# EAGLE schematic TigardBR (EAGLE 9.6.2)
H1: Controlando Elétrons; H2: github.com/ControlandoEletrons; PROJECT: TigardBR; VERSION: 1.0
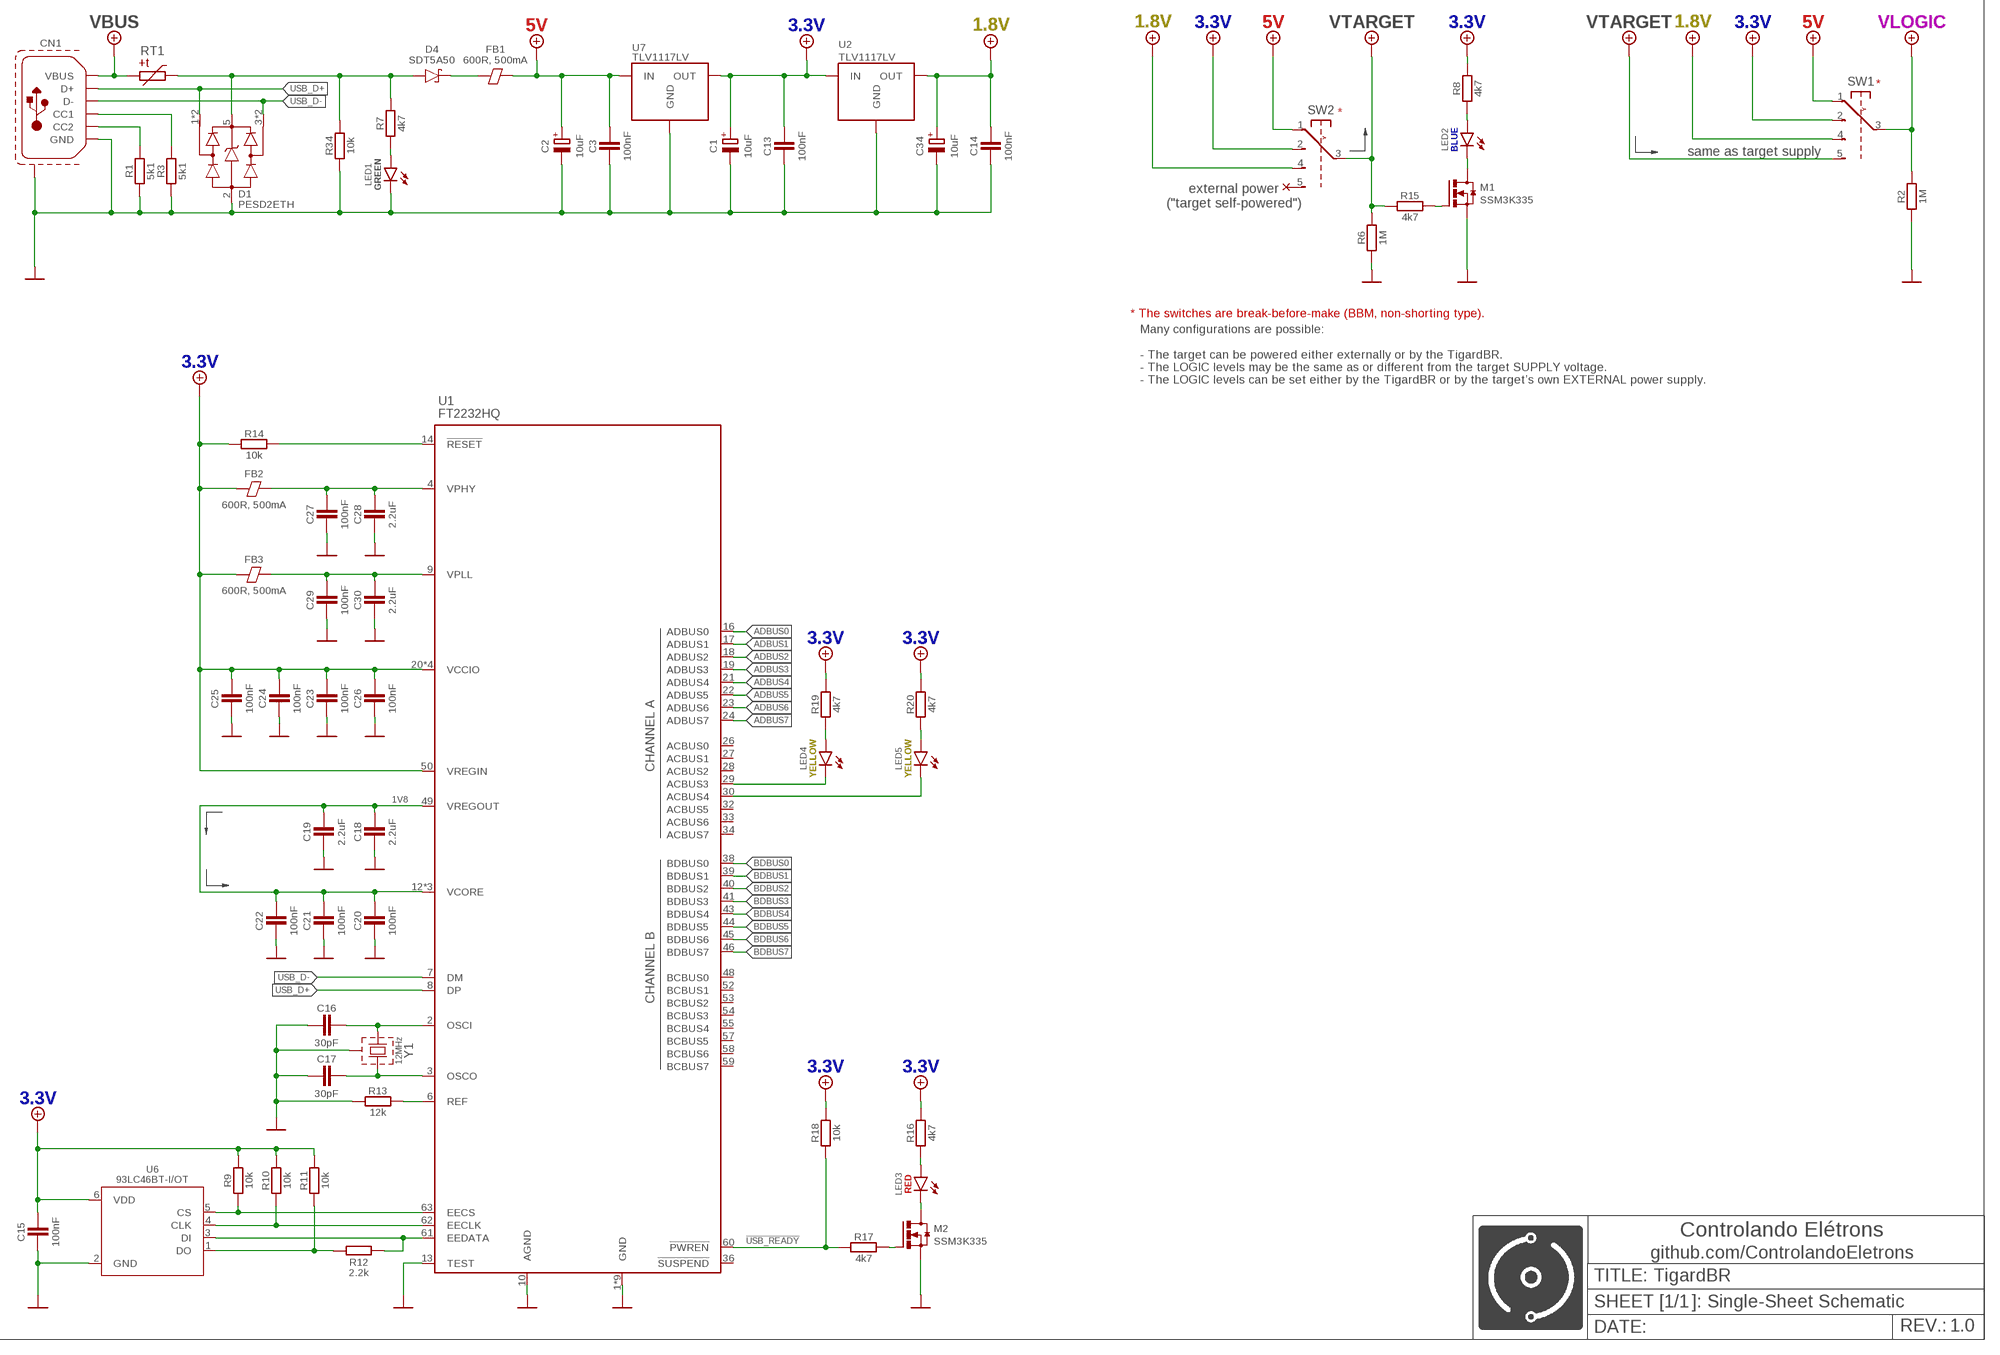
[diagram p0: schematic, sheet 1, part 1 of 3]
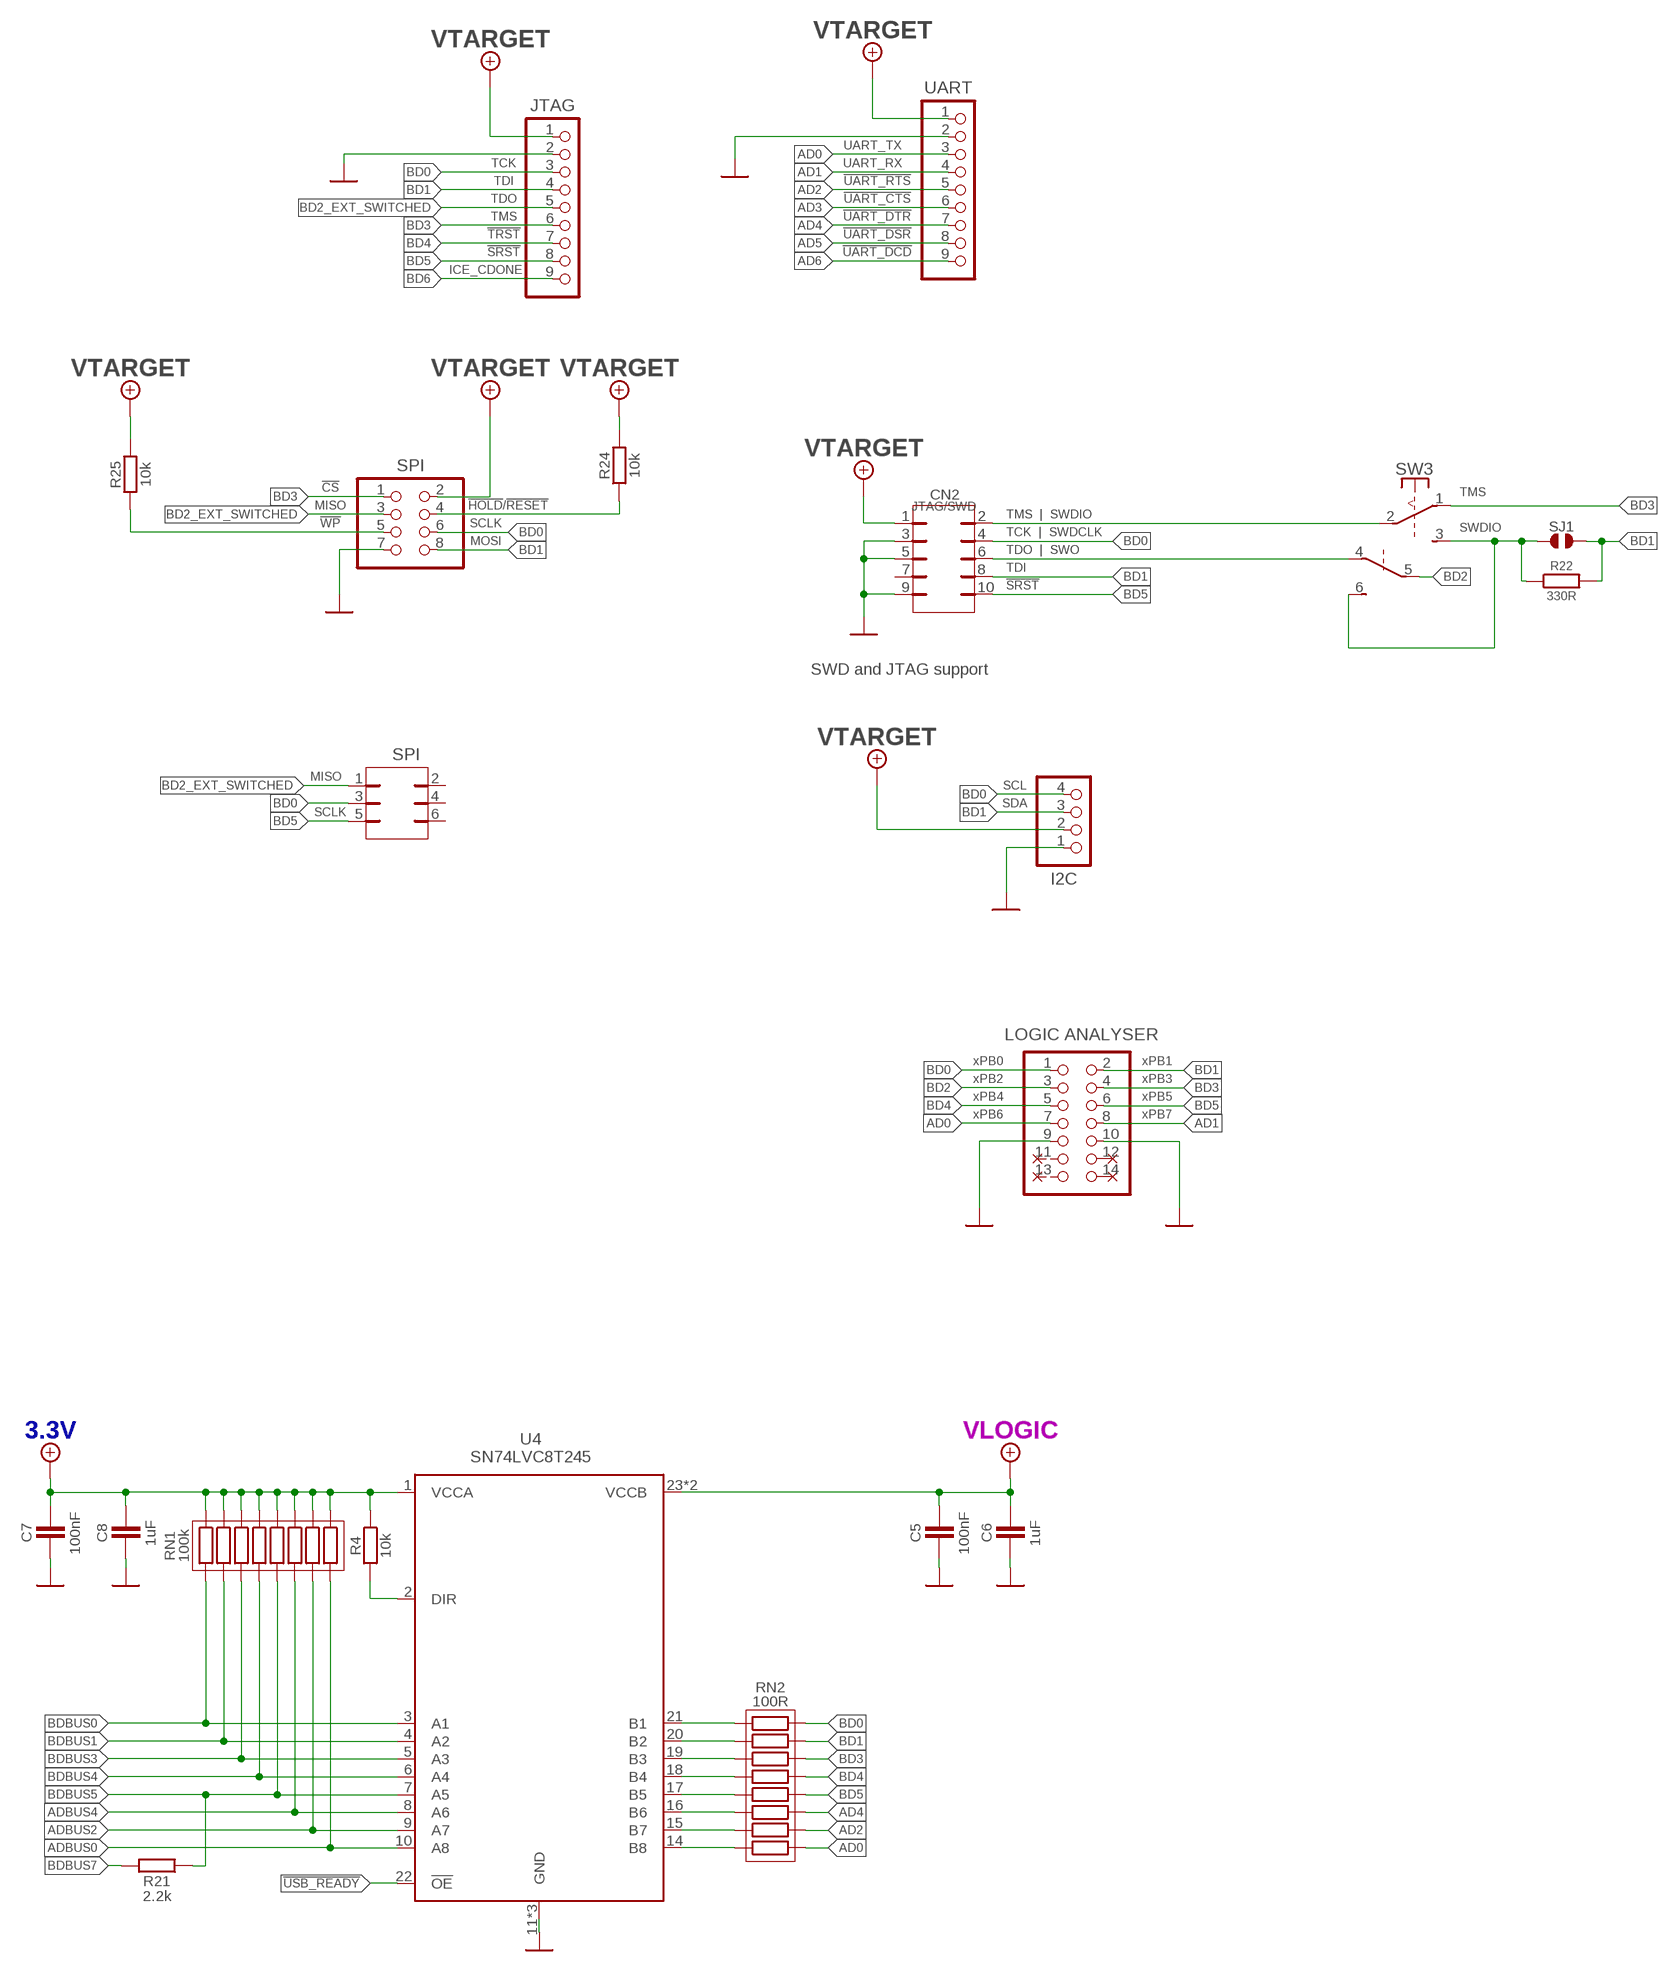
[diagram p1: schematic, sheet 1, part 2 of 3]
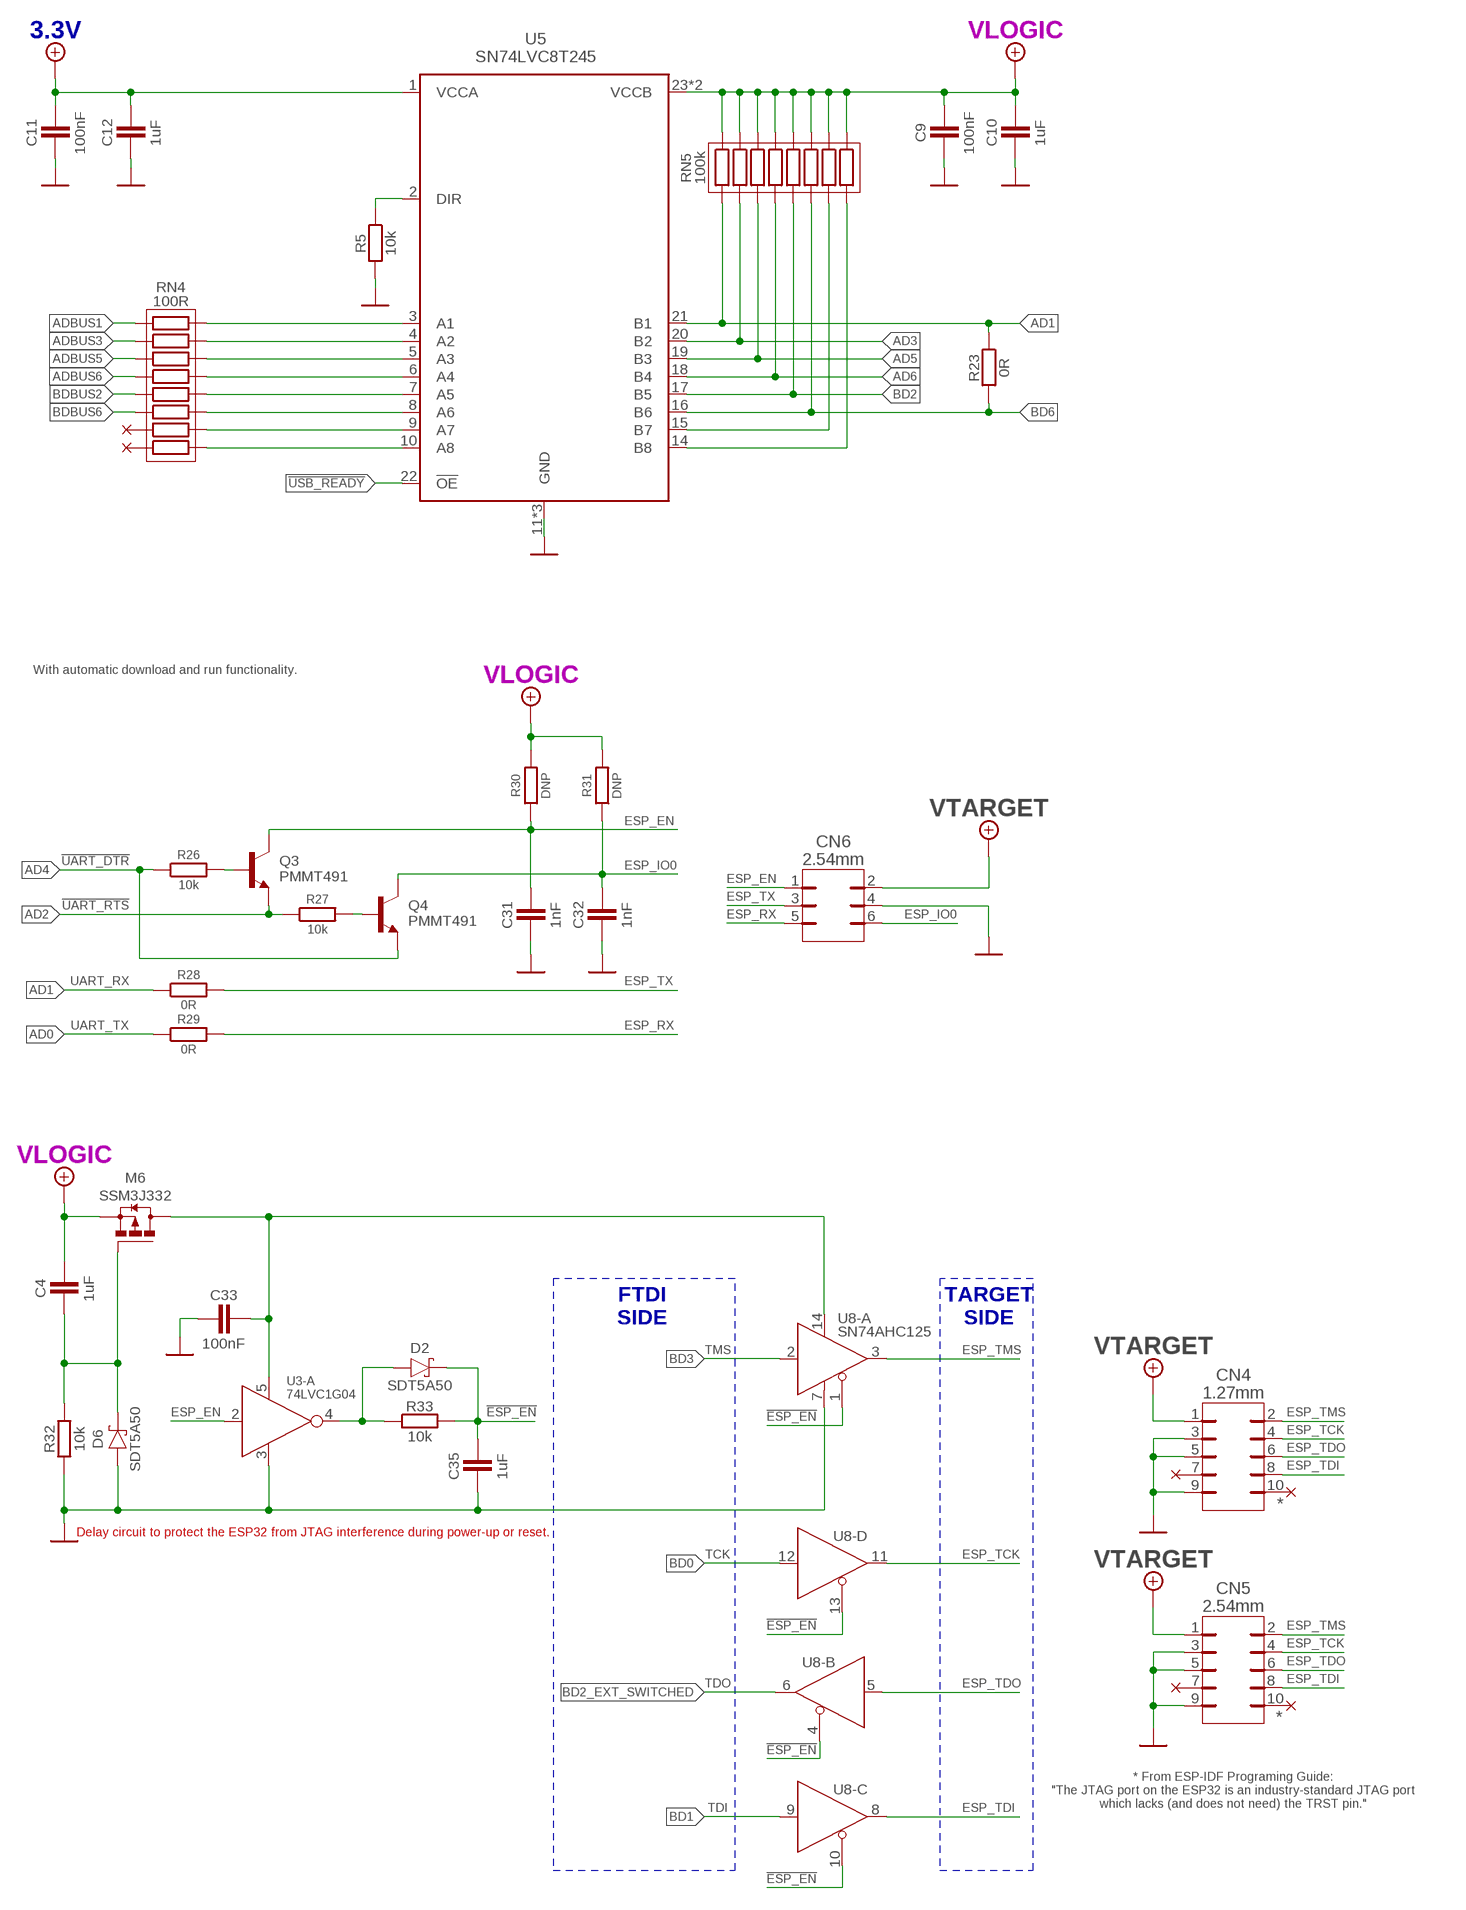
[diagram p2: schematic, sheet 1, part 3 of 3]
U$1 (NC): _EXTERNAL_: _EXTERNAL_
U$2 (NC): _EXTERNAL_: _EXTERNAL_
U$3 (NC): _EXTERNAL_: _EXTERNAL_
U$4 (NC): _EXTERNAL_: _EXTERNAL_
U$5 (NC): _EXTERNAL_: _EXTERNAL_
U$6 (NC): _EXTERNAL_: _EXTERNAL_
U$7 (NC): _EXTERNAL_: _EXTERNAL_
U$8 (NC): _EXTERNAL_: _EXTERNAL_
U$9 (NC): _EXTERNAL_: _EXTERNAL_
U$10 (NC): _EXTERNAL_: _EXTERNAL_
U$11 (NC): _EXTERNAL_: _EXTERNAL_
U$12 (NC): _EXTERNAL_: _EXTERNAL_

## Parts
C1  10uF  CP_1206_POL  [C1206_POL]
C2  10uF  CP_1206_POL  [C1206_POL]
C3  100nF  C_0603  [C0603]
C4  1uF  C_0603  [C0603]
C5  100nF  C_0603  [C0603]
C6  1uF  C_0603  [C0603]
C7  100nF  C_0603  [C0603]
C8  1uF  C_0603  [C0603]
C9  100nF  C_0603  [C0603]
C10  1uF  C_0603  [C0603]
C11  100nF  C_0603  [C0603]
C12  1uF  C_0603  [C0603]
C13  100nF  C_0603  [C0603]
C14  100nF  C_0603  [C0603]
C15  100nF  C_0603  [C0603]
C16  30pF  C_0603  [C0603]
C17  30pF  C_0603  [C0603]
C18  2.2uF  C_0603  [C0603]
C19  2.2uF  C_0603  [C0603]
C20  100nF  C_0603  [C0603]
C21  100nF  C_0603  [C0603]
C22  100nF  C_0603  [C0603]
C23  100nF  C_0603  [C0603]
C24  100nF  C_0603  [C0603]
C25  100nF  C_0603  [C0603]
C26  100nF  C_0603  [C0603]
C27  100nF  C_0603  [C0603]
C28  2.2uF  C_0603  [C0603]
C29  100nF  C_0603  [C0603]
C30  2.2uF  C_0603  [C0603]
C31  1nF  C_0603  [C0603]
C32  1nF  C_0603  [C0603]
C33  100nF  C_0603  [C0603]
C34  10uF  CP_1206_POL  [C1206_POL]
C35  1uF  C_0603  [C0603]
CN1  USB-C-16P  [USB-C-16P]
CN2  JTAG/SWD  JTAG  [JTAG-ARM-10P]
CN3  I2C  PINHD-1X04_2.54  [1X04]
CN4  1.27mm  JTAG  [JTAG-ARM-10P]
CN5  2.54mm  PINHD-2X05_2.54  [2X05]
CN6  2.54mm  PINHD-2X03_2.54  [2X03]
D1  TVS-ARRAY-2  [TSOP-6]
D2  SDT5A50  SCHOTTKY-SDT5A50SA  [DO-214AC]
D4  SDT5A50  SCHOTTKY-SDT5A50SA  [DO-214AC]
D6  SDT5A50  SCHOTTKY-SDT5A50SA  [DO-214AC]
FB1  600R, 500mA  FB_0603  [L0603]
FB2  600R, 500mA  FB_0603  [L0603]
FB3  600R, 500mA  FB_0603  [L0603]
JP1  JTAG  PINHD-1X09_2.54  [1X09]
JP2  SPI  PINHD-2X04_2.54  [2X04]
JP3  UART  PINHD-1X09_2.54  [1X09]
JP4  LOGIC ANALYSER  PINHD-2X07_2.54  [2X07]
JP5  SPI  PINHD-2X03_2.54  [2X03]
LED1  GREEN  LED-0603-G  [L0603G]
LED2  BLUE  LED-0603-B  [L0603B]
LED3  RED  LED-0603-R  [L0603R]
LED4  YELLOW  LED-0603-Y  [L0603Y]
LED5  YELLOW  LED-0603-Y  [L0603Y]
M1  SSM3K335  MOSFET-N-SSM3K335R  [SOT23-3]
M2  SSM3K335  MOSFET-N-SSM3K335R  [SOT23-3]
M6  SSM3J332  MOSFET-P-SSM3J332R  [SOT23-3]
Q3  PMMT491  BJT-N-PMMT491  [SOT23-3]
Q4  PMMT491  BJT-N-PMMT491  [SOT23-3]
R1  5k1  R_0603  [R0603]
R2  1M  R_0603  [R0603]
R3  5k1  R_0603  [R0603]
R4  10k  R_0603  [R0603]
R5  10k  R_0603  [R0603]
R6  1M  R_0603  [R0603]
R7  4k7  R_0603  [R0603]
R8  4k7  R_0603  [R0603]
R9  10k  R_0603  [R0603]
R10  10k  R_0603  [R0603]
R11  10k  R_0603  [R0603]
R12  2.2k  R_0603  [R0603]
R13  12k  R_0603  [R0603]
R14  10k  R_0603  [R0603]
R15  4k7  R_0603  [R0603]
R16  4k7  R_0603  [R0603]
R17  4k7  R_0603  [R0603]
R18  10k  R_0603  [R0603]
R19  4k7  R_0603  [R0603]
R20  4k7  R_0603  [R0603]
R21  2.2k  R_0603  [R0603]
R22  330R  R_0603  [R0603]
R23  0R  R_0603  [R0603]
R24  10k  R_0603  [R0603]
R25  10k  R_0603  [R0603]
R26  10k  R_0603  [R0603]
R27  10k  R_0603  [R0603]
R28  0R  R_0603  [R0603]
R29  0R  R_0603  [R0603]
R30  DNP  R_0603  [R0603]
R31  DNP  R_0603  [R0603]
R32  10k  R_0603  [R0603]
R33  10k  R_0603  [R0603]
R34  10k  R_0603  [R0603]
RN1  100k  RN_  [RN0602]
RN2  100R  RN_  [RN0602]
RN4  100R  RN_  [RN0602]
RN5  100k  RN_  [RN0602]
RT1  PTC-  [F1812]
SJ1  2P-NO  [2P-NO-0603]
SW1  DP4T-  [SSSS224100]
SW2  DP4T-  [SSSS224100]
SW3  DP2T-STRAIGHT-SMD  [JS202011SCQN]
U1  FT2232HQ  [QFN-64]
U2  TLV1117LV  1117-3.3V  [SOT-223-3]
U3  74LVC1G04  SINGLE-INVERTER-74LVC1G04GV  [SOT753-5_(SC-74A)]
U4  SN74LVC8T245  [TSSOP-24]
U5  SN74LVC8T245  [TSSOP-24]
U6  93LC46BT-I/OT  [SOT23-6]
U7  TLV1117LV  1117-3.3V  [SOT-223-3]
U8  SN74AHC125  QUAD-BUFFER-  [SOIC-14]
Y1  12MHz  OSC-CHASSI-  [3.2MM_2.5MM]

## Nets
0V: C1.2(-) C2.2(-) C3.2 C5.2 C6.2 C7.2 C8.2 C9.2 C10.2 C11.2 C12.2 C13.2 C14.2 C15.2 C16.2 C17.2 C18.2 C19.2 C20.2 C21.2 C22.2 C23.2 C24.2 C25.2 C26.2 C27.2 C28.2 C29.2 C30.2 C31.2 C32.2 C33.2 C34.2(-) C35.2 CN1.A1_B12(GND) CN1.B1_A12(GND) CN1.S1(CHASSI) CN1.S2(CHASSI) CN1.S3(CHASSI) CN1.S4(CHASSI) CN2.3(GND) CN2.5(GND2) CN2.9(GND3) CN3.1 CN4.3(GND) CN4.5(GND2) CN4.9(GND3) CN5.3 CN5.5 CN5.9 CN6.4 D1.2(GND) D6.2(A) JP1.2 JP2.7 JP3.2 JP4.9 JP4.10 LED1.K M1.2(S) M2.2(S) R1.1 R2.1 R3.1 R5.2 R6.1 R13.2 R32.1 R34.1 U1.1(GND) U1.5(GND) U1.10(AGND) U1.11(GND) U1.13(TEST) U1.15(GND) U1.25(GND) U1.35(GND) U1.47(GND) U1.51(GND) U1.TP(GND) U2.1(GND) U3.3(VSS) U4.11(GND) U4.12(GND) U4.13(GND) U5.11(GND) U5.12(GND) U5.13(GND) U6.2(GND) U7.1(GND) U8.7(VSS) Y1.2(CH) Y1.4(CH)
1.8V: C14.1 C34.1(+) SW1.4(NO2) SW2.4(NO2) U2.2(OUT) U2.4(OUT)
1V8: C18.1 C19.1 C20.1 C21.1 C22.1 U1.12(VCORE) U1.37(VCORE) U1.49(VREGOUT) U1.64(VCORE)
3.3V: C1.1(+) C7.1 C8.1 C11.1 C12.1 C13.1 C15.1 C23.1 C24.1 C25.1 C26.1 FB2.1 FB3.1 R4.1 R8.2 R9.1 R10.1 R11.1 R14.2 R16.2 R18.1 R19.2 R20.2 RN1.1 RN1.2 RN1.3 RN1.4 RN1.5 RN1.6 RN1.7 RN1.8 SW1.2(NO1) SW2.2(NO1) U1.20(VCCIO) U1.31(VCCIO) U1.42(VCCIO) U1.50(VREGIN) U1.56(VCCIO) U2.3(IN) U4.1(VCCA) U5.1(VCCA) U6.6(VDD) U7.2(OUT) U7.4(OUT)
5.0V: C2.1(+) C3.1 FB1.2 SW1.1(NC) SW2.1(NC) U7.3(IN) ; supply symbol labelled 5V
!ESP_EN: C35.1 D2.1(K) R33.2 U8.1(-A:!OE) U8.4(-B:!OE) U8.10(-C:!OE) U8.13(-D:!OE)
!USB_READY: R17.1 R18.2 U1.60(!PWREN) U4.22(!OE) U5.22(!OE)
AD0: JP3.3 JP4.7 R29.1 RN2.9
AD1: JP3.4 JP4.8 R23.1 R28.1 RN5.16 U5.21(B1)
AD2: JP3.5 Q3.2(E) R27.1 RN2.10
AD3: JP3.6 RN5.15 U5.20(B2)
AD4: JP3.7 Q4.2(E) R26.1 RN2.11
AD5: JP3.8 RN5.14 U5.19(B3)
AD6: JP3.9 RN5.13 U5.18(B4)
ADBUS0: RN1.9 RN5.9 U1.16(ADBUS0) U4.10(A8) U5.14(B8)
ADBUS1: RN4.1 U1.17(ADBUS1)
ADBUS2: RN1.10 RN5.10 U1.18(ADBUS2) U4.9(A7) U5.15(B7)
ADBUS3: RN4.2 U1.19(ADBUS3)
ADBUS4: RN1.11 U1.21(ADBUS4) U4.8(A6)
ADBUS5: RN4.3 U1.22(ADBUS5)
ADBUS6: RN4.4 U1.23(ADBUS6)
ADBUS7: U1.24(ADBUS7)
BD0: CN2.4(TCK) CN3.4 JP1.3 JP2.6 JP4.1 JP5.3 RN2.16 U8.12(-D:A)
BD1: CN2.8(TDI) CN3.3 JP1.4 JP2.8 JP4.2 R22.2 RN2.15 SJ1.2 U8.9(-C:A)
BD2: JP4.3 RN5.12 SW3.5(SW2:C) U5.17(B5)
BD2_EXT_SWITCHED: CN2.6(TDO) JP1.5 JP2.3 JP5.1 SW3.4(SW2:NC) U8.6(-B:Y)
BD3: JP1.6 JP2.1 JP4.4 RN2.14 SW3.1(SW1:NC) U8.2(-A:A)
BD4: JP1.7 JP4.5 RN2.13
BD5: CN2.10(!RST) JP1.8 JP4.6 JP5.5 RN2.12
BD6: JP1.9 R23.2 RN5.11 U5.16(B6)
BDBUS0: RN1.16 U1.38(BDBUS0) U4.3(A1)
BDBUS1: RN1.15 U1.39(BDBUS1) U4.4(A2)
BDBUS2: RN4.5 U1.40(BDBUS2)
BDBUS3: RN1.14 U1.41(BDBUS3) U4.5(A3)
BDBUS4: RN1.13 U1.43(BDBUS4) U4.6(A4)
BDBUS5: R21.1 RN1.12 U1.44(BDBUS5) U4.7(A5)
BDBUS6: RN4.6 U1.45(BDBUS6)
BDBUS7: R21.2 U1.46(BDBUS7)
ESP_EN: C31.1 CN6.1 Q3.3(C) R30.1 U3.2(-A:A)
ESP_IO0: C32.1 CN6.6 Q4.3(C) R31.1
ESP_RX: CN6.5 R29.2
ESP_TCK: CN4.4(TCK) CN5.4 U8.11(-D:Y)
ESP_TDI: CN4.8(TDI) CN5.8 U8.8(-C:Y)
ESP_TDO: CN4.6(TDO) CN5.6 U8.5(-B:A)
ESP_TMS: CN4.2(TMS) CN5.2 U8.3(-A:Y)
ESP_TX: CN6.3 R28.2
N$1: LED2.A R8.1
N$2: R4.2 U4.2(DIR)
N$3: R5.1 U5.2(DIR)
N$4: RN4.16 U5.3(A1)
N$5: RN4.15 U5.4(A2)
N$6: RN4.14 U5.5(A3)
N$7: D4.1(K) FB1.1
N$8: RN4.13 U5.6(A4)
N$9: RN4.12 U5.7(A5)
N$10: RN4.11 U5.8(A6)
N$11: RN4.10 U5.9(A7)
N$12: RN2.1 U4.21(B1)
N$13: RN2.2 U4.20(B2)
N$14: RN2.3 U4.19(B3)
N$15: RN2.4 U4.18(B4)
N$16: RN2.5 U4.17(B5)
N$17: RN2.6 U4.16(B6)
N$18: RN2.7 U4.15(B7)
N$19: RN2.8 U4.14(B8)
N$20: LED2.K M1.3(D)
N$21: RN4.9 U5.10(A8)
N$22: R9.2 U1.63(EECS) U6.5(CS)
N$23: R10.2 U1.62(EECLK) U6.4(CLK)
N$24: R11.2 R12.2 U6.1(DO)
N$25: R12.1 U1.61(EEDATA) U6.3(DI)
N$26: LED1.A R7.1
N$27: C16.1 U1.2(OSCI) Y1.1(IN)
N$28: C17.1 U1.3(OSCO) Y1.3(OUT)
N$29: R13.1 U1.6(REF)
N$30: R14.1 U1.14(!RESET)
N$31: C27.1 C28.1 FB2.2 U1.4(VPHY)
N$32: C29.1 C30.1 FB3.2 U1.9(VPLL)
N$33: M1.1(G) R15.2
N$34: LED3.A R16.1
N$35: LED3.K M2.3(D)
N$36: M2.1(G) R17.2
N$37: LED4.A R19.1
N$38: LED4.K U1.29(ACBUS3)
N$39: CN1.A5(CC1) R3.2
N$40: CN1.B5(CC2) R1.2
N$41: LED5.K U1.30(ACBUS4)
N$42: LED5.A R20.1
N$43: CN2.2(TMS) SW3.2(SW1:C)
N$44: JP2.4 R24.1
N$45: JP2.5 R25.1
N$46: Q3.1(B) R26.2
N$47: Q4.1(B) R27.2
N$48: D1.5(VCC) D4.2(A) R7.2 R34.2 RT1.1
N$49: C4.2 D6.1(K) M6.1(G) R32.2
N$50: C33.1 M6.3(D) U3.5(VDD) U8.14(VDD)
N$51: D2.2(A) R33.1 U3.4(-A:Y)
SWDIO: R22.1 SJ1.1 SW3.3(SW1:NO) SW3.6(SW2:NO)
USB_D+: CN1.A6(D+) CN1.B6(D+) D1.1(IO1) D1.6(IO1) U1.8(DP)
USB_D-: CN1.A7(D-) CN1.B7(D-) D1.3(IO2) D1.4(IO2) U1.7(DM)
VBUS: CN1.A4_B9(VBUS) CN1.B4_A9(VBUS) RT1.2
VLOGIC: C4.1 C5.1 C6.1 C9.1 C10.1 M6.2(S) R2.2 R30.2 R31.2 RN5.1 RN5.2 RN5.3 RN5.4 RN5.5 RN5.6 RN5.7 RN5.8 SW1.3(C) U4.23(VCCB) U4.24(VCCB) U5.23(VCCB) U5.24(VCCB)
VTARGET: CN2.1(VDD) CN3.2 CN4.1(VDD) CN5.1 CN6.2 JP1.1 JP2.2 JP3.1 R6.2 R15.1 R24.2 R25.2 SW1.5(NO3) SW2.3(C)
Unconnected: CN2.7 CN4.7 CN4.10(!RST) CN5.7 CN5.10 JP4.11 JP4.12 JP4.13 JP4.14 JP5.2 JP5.4 JP5.6 RN4.7 RN4.8 SW1.6(NC) SW1.7(NO1) SW1.8(C) SW1.9(NO2) SW1.10(NO3) SW2.5(NO3) SW2.6(NC) SW2.7(NO1) SW2.8(C) SW2.9(NO2) SW2.10(NO3) U1.26(ACBUS0) U1.27(ACBUS1) U1.28(ACBUS2) U1.32(ACBUS5) U1.33(ACBUS6) U1.34(ACBUS7) U1.36(!SUSPEND) U1.48(BCBUS0) U1.52(BCBUS1) U1.53(BCBUS2) U1.54(BCBUS3) U1.55(BCBUS4) U1.57(BCBUS5) U1.58(BCBUS6) U1.59(BCBUS7)

## Notes on the sheet
- UART_TX
- TCK | UART_RX
- TDI | !UART_RTS
- TDO | !UART_CTS
- TMS | !UART_DTR
- !TRST | !UART_DSR
- !SRST | !UART_DCD
- ICE_CDONE
- !CS
- TMS
- MISO | !HOLD!/!RESET!
- TMS  |  SWDIO
- !WP | SCLK
- SWDIO
- TCK  |  SWDCLK
- MOSI
- TDO  |  SWO
- TDI
- !SRST
- SWD and JTAG support
- MISO
- SCL
- SDA
- SCLK
- *
- *
- same as target supply
- external power
  ("target self-powered")
- xPB0 | xPB1
- xPB2 | xPB3
- xPB4 | xPB5
- xPB6 | xPB7
- * The switches are break-before-make (BBM, non-shorting type).
- Many configurations are possible:
  
  - The target can be powered either externally or by the TigardBR.
  - The LOGIC levels may be the same as or different from the target SUPPLY voltage.
  - The LOGIC levels can be set either by the TigardBR or by the target’s own EXTERNAL power supply.
- With automatic download and run functionality.
- !UART_DTR
- !UART_RTS
- UART_RX
- UART_TX
- FTDI
  SIDE
- TARGET
  SIDE
- TMS
- *
- Delay circuit to protect the ESP32 from JTAG interference during power-up or reset.
- TCK
- TDO
- *
- * From ESP-IDF Programing Guide:
  "The JTAG port on the ESP32 is an industry-standard JTAG port
  which lacks (and does not need) the TRST pin."
- TDI

## Library data of the parts
C1 C2 C34 = My-RLC:CP_: POLARIZED CAP; PN: T494A106M016AT
C3 C4 C13 C14 C35 = My-RLC:C_: NON-POLARIZED CAP; PN: CL10B104JB8NNNC
C5-C12 C15-C33 = My-RLC:C_: NON-POLARIZED CAP
CN1 = My-Connectors:USB-C-16P; PN: USB4105-GF-A
CN2 = My-Connectors:JTAG; PN: 20021121-00010C4LF
CN3 = My-PinHeaders:PINHD-1X04: PIN HEADER
CN4 = My-Connectors:JTAG; PN: 20021121-00010C4LF; VALUE: JTAG/SWD
CN5 = My-PinHeaders:PINHD-2X05: PIN HEADER
CN6 JP5 = My-PinHeaders:PINHD-2X03: PIN HEADER
D1 = My-Diodes:TVS-ARRAY-2; FAMILY: PESD2ETH; PN: PESD2ETH-ADX
D2 D4 D6 = My-Diodes:SCHOTTKY-: Schottky Diodes (single in package); IF: 5A; PN: SDT5A50SAF-13; VF: 0.52V; VR: 50V
FB1-FB3 = My-RLC:FB_: FERRITE BEAD; PN: BLM15AX601SN1D
JP1 JP3 = My-PinHeaders:PINHD-1X09: PIN HEADER
JP2 = My-PinHeaders:PINHD-2X04: PIN HEADER
JP4 = My-PinHeaders:PINHD-2X07: PIN HEADER
LED1 = My-LEDs:LED-: Light-Emitting Diode (LED); IF: 20mA; PN: 150060GS75000; VF: 3.2V
LED2 = My-LEDs:LED-: Light-Emitting Diode (LED); IF: 20mA; PN: 150060BS75000; VF: 3.2V
LED3 = My-LEDs:LED-: Light-Emitting Diode (LED); IF: 20mA; PN: 150060RS75000; VF: 2.0V
LED4 LED5 = My-LEDs:LED-: Light-Emitting Diode (LED); IF: 20mA; PN: 150060YS75000; VF: 2.0V
M1 M2 = My-Transistors:MOSFET-N-: N-channel Enhancement Mode Field Effect Transistor; ID: 6A; PN: SSM3K335R,LF; VDS: 30V; VGS: 20V
M6 = My-Transistors:MOSFET-P-: P-channel Enhancement Mode Field Effect Transistor; ID: 6A; PN: SSM3J332R,LF; VDS: 30V; VGS: 12V
Q3 Q4 = My-Transistors:BJT-N-: Bipolar Junction Transistor - NPN; IC: 1A; PN: PMMT491A,215; VCE: 500mV; VCEO: 40V
R1 R3 = My-RLC:R_: RESISTOR; PN: ERJ3EKF5101V
R2 R4-R6 R9-R14 R18 R21-R31 = My-RLC:R_: RESISTOR
R7 R8 R15-R17 R19 R20 R32-R34 = My-RLC:R_: RESISTOR; PN: ERJPA3F1002V
RN1 RN5 = My-RLC:RN_; PN: EXB-2HV104JV
RN2 RN4 = My-RLC:RN_; PN: EXB-2HV101JV
RT1 = My-Sensors:PTC-; PN: miniSMDC050F-2; TYPE: +t
SJ1 = My-Jumpers:2P-NO: SMD Solder Jumper
SW1 SW2 = My-Switches:DP4T-: Double-Pole Four-Throw (DP4T) Latching Switch; PN: SSSS224100
SW3 = My-Switches:DP2T-: Double-Pole Two-Throw (DP2T) Latching Switch; PN: JS202011SCQN
U1 = My-ICs:FT2232HQ: FT2232H Dual High Speed USB to Multipurpose UART/FIFO IC; PN: FT2232HQ
U2 = My-LDOs:1117-: Positive Fixed-Voltage, Low-Dropout Regulator; PN: TLV1117LV18DCYR
U3 = My-ICs:SINGLE-INVERTER-: Single inverter; PN: 74LVC1G04GV,125
U4 U5 = My-ICs:SN74LVC8T245: 8-Bit Dual-Supply Bus Transceiver; PN: SN74LVC8T245PWR
U6 = My-ICs:93LC46B: 1-Kbit 2.5V Microwire Serial EEPROM; PN: 93LC46BT-I/OT
U7 = My-LDOs:1117-: Positive Fixed-Voltage, Low-Dropout Regulator; PN: TLV1117LV33DCYR
U8 = My-ICs:QUAD-BUFFER-; PN: SN74AHC125DR
Y1 = My-Crystals:OSC-CHASSI-: Crystal with pins connected to chassis.; PN: X322512MSB4SI